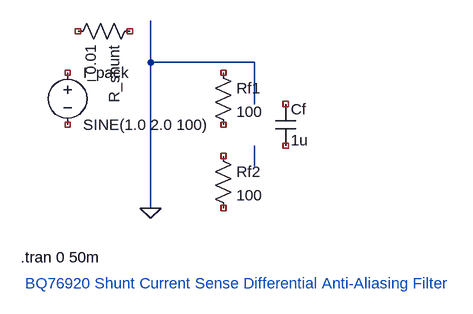
[diagram p0: schematic shunt_current_sense.asc]
shunt_current_sense.asc, the LTspice schematic file:
Version 4
SHEET 1 880 680
WIRE 0 0 0 -64
WIRE 160 0 0 0
WIRE 160 64 160 0
WIRE 160 160 160 128
WIRE 0 160 0 0
WIRE 0 224 0 160
FLAG 0 224 0
SYMBOL res -16 -64 R90
SYMATTR InstName R_shunt
SYMATTR Value 0.01
SYMBOL res 96 0 R0
SYMATTR InstName Rf1
SYMATTR Value 100
SYMBOL res 96 128 R0
SYMATTR InstName Rf2
SYMATTR Value 100
SYMBOL cap 192 64 R0
SYMATTR InstName Cf
SYMATTR Value 1u
SYMBOL voltage -128 0 R0
SYMATTR InstName I_pack
SYMATTR Value SINE(1.0 2.0 100)
TEXT -200 300 Left 2 !.tran 0 50m
TEXT -200 340 Left 2 ; BQ76920 Shunt Current Sense Differential Anti-Aliasing Filter

The netlist it stands for:
* shunt_current_sense.asc
R_shunt NC_01 NC_02 0.01
Rf1 NC_03 NC_04 100
Rf2 NC_05 NC_06 100
Cf NC_07 NC_08 1u
V§I_pack NC_09 NC_10 SINE(1.0 2.0 100)
.tran 0 50m
*  BQ76920 Shunt Current Sense Differential Anti-Aliasing Filter
.backanno
.end